# Altium schematic sheet IO_Expanders.SchDoc
size Letter
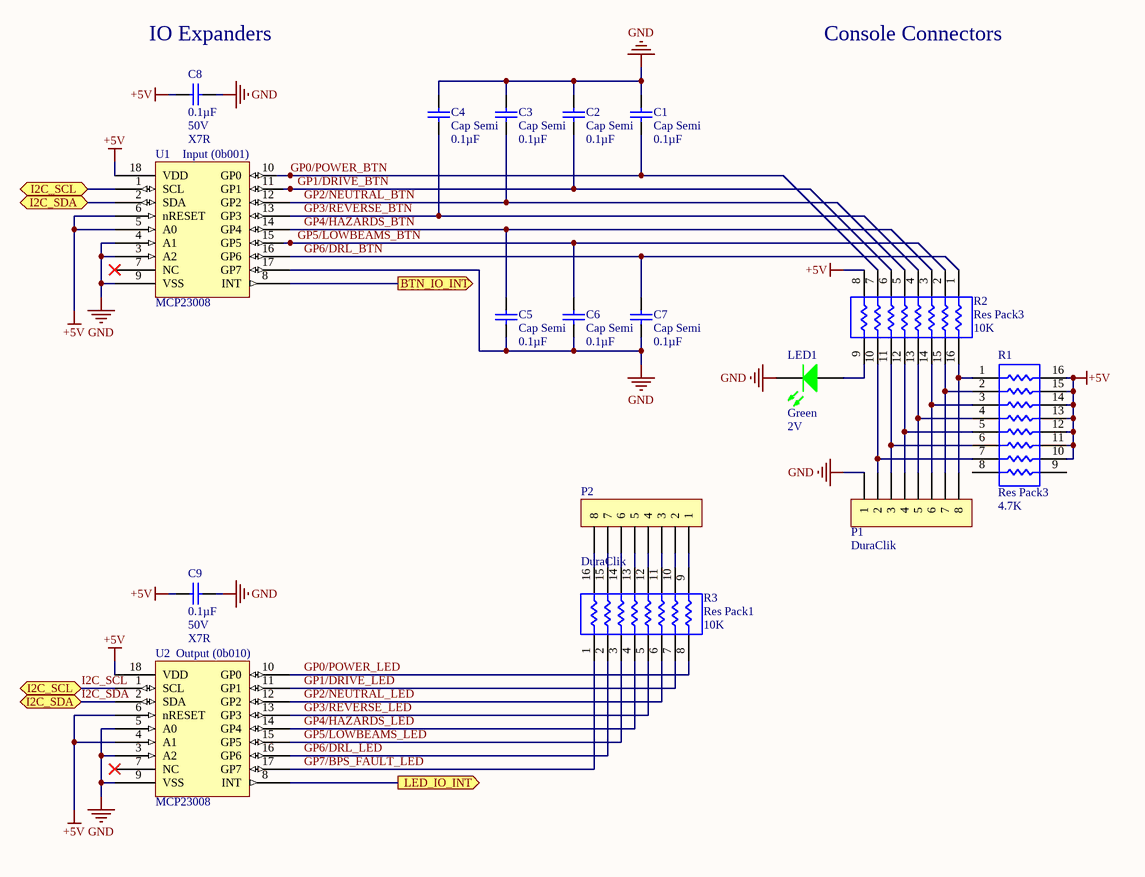
[diagram p0: IO_Expanders.SchDoc]

## Parts
C1  Cap Semi  value 0.1µF  [C1206]
C2  Cap Semi  value 0.1µF  [C1206]
C3  Cap Semi  value 0.1µF  [C1206]
C4  Cap Semi  value 0.1µF  [C1206]
C5  Cap Semi  value 0.1µF  [C1206]
C6  Cap Semi  value 0.1µF  [C1206]
C7  Cap Semi  value 0.1µF  [C1206]
C8  Capacitance: 0.1µF  Voltage: 50V  Temperature Coefficient: X7R  [CAP, 0603]  (hidden comment: CAP CER 0.1UF 50V 10% X7R 0603)
C9  Capacitance: 0.1µF  Voltage: 50V  Temperature Coefficient: X7R  [CAP, 0603]  (hidden comment: CAP CER 0.1UF 50V 10% X7R 0603)
LED1  Color: Green  Voltage - Forward (Vf) (Typ): 2V  [LED_0603]  (hidden comment: LED GREEN CLEAR 2V 0603)
P1  Series: DuraClik  [CONN, 8POS Dura-Clik]  (hidden comment: CONN 8POS DURA-CLIK 0.079")
P2  Series: DuraClik  [CONN, 8POS Dura-Clik]  (hidden comment: CONN 8POS DURA-CLIK 0.079")
R1  Res Pack3  value 4.7K  [SO-16_N]
R2  Res Pack3  value 10K  [SO-16_N]
R3  Res Pack1  value 10K  [SO-16_N]
U1  MCP23008  [IC 18SOIC]
U2  MCP23008  [IC 18SOIC]

## Ports
BTN_IO_INT (out), I2C_SCL (bidir), I2C_SDA (bidir), LED_IO_INT (out)

## Nets
+5V: C8.1 C9.1 R1.10 R1.11 R1.12 R1.13 R1.14 R1.15 R1.16 R2.8 U1.5(A0) U1.6(nRESET) U1.18(VDD) U2.4(A1) U2.6(nRESET) U2.18(VDD)
GND: C1.2 C2.1 C3.1 C4.1 C5.2 C6.2 C7.2 C8.2 C9.2 LED1.2(K) P1.1 U1.3(A2) U1.4(A1) U1.9(VSS) U1.17(GP7) U2.3(A2) U2.5(A0) U2.9(VSS)
BTN_IO_INT: U1.8(INT) ; port BTN_IO_INT
GP0/POWER_BTN: C1.1 R2.7 U1.10(GP0)
GP0/POWER_LED: R3.8 U2.10(GP0)
GP1/DRIVE_BTN: C2.2 R2.6 U1.11(GP1)
GP1/DRIVE_LED: R3.7 U2.11(GP1)
GP2/NEUTRAL_BTN: C3.2 R2.5 U1.12(GP2)
GP2/NEUTRAL_LED: R3.6 U2.12(GP2)
GP3/REVERSE_BTN: C4.2 R2.4 U1.13(GP3)
GP3/REVERSE_LED: R3.5 U2.13(GP3)
GP4/HAZARDS_BTN: C5.1 R2.3 U1.14(GP4)
GP4/HAZARDS_LED: R3.4 U2.14(GP4)
GP5/LOWBEAMS_BTN: C6.1 R2.2 U1.15(GP5)
GP5/LOWBEAMS_LED: R3.3 U2.15(GP5)
GP6/DRL_BTN: C7.1 R2.1 U1.16(GP6)
GP6/DRL_LED: R3.2 U2.16(GP6)
GP7/BPS_FAULT_LED: R3.1 U2.17(GP7)
I2C_SCL: U1.1(SCL) U2.1(SCL) ; port I2C_SCL
I2C_SDA: U1.2(SDA) U2.2(SDA) ; port I2C_SDA
LED_IO_INT: U2.8(INT) ; port LED_IO_INT
NetLED1_1: LED1.1(A) R2.9
NetP1_2: P1.2 R1.7 R2.10
NetP1_3: P1.3 R1.6 R2.11
NetP1_4: P1.4 R1.5 R2.12
NetP1_5: P1.5 R1.4 R2.13
NetP1_6: P1.6 R1.3 R2.14
NetP1_7: P1.7 R1.2 R2.15
NetP1_8: P1.8 R1.1 R2.16
NetP2_1: P2.1 R3.9
NetP2_2: P2.2 R3.10
NetP2_3: P2.3 R3.11
NetP2_4: P2.4 R3.12
NetP2_5: P2.5 R3.13
NetP2_6: P2.6 R3.14
NetP2_7: P2.7 R3.15
NetP2_8: P2.8 R3.16

Not connected (* = marked no-connect by the designer): R1 8 9; U1 7(NC)*; U2 7(NC)*

## Notes on the sheet
- (near C8) IO Expanders
- Console Connectors
- (near U1) Input (0b001)
- (near U2) Output (0b010)
- Project:
- Title:
- Size:
- Project Author
- Letter
- Revision:
- University of Waterloo
- 200 University Ave W
- Waterloo, ON, Canada
- N2L 3E9
- Date:
- Sheet
- of
- Website:

## Library data of the parts
C1-C7 = Cap Semi: Capacitor (Semiconductor SIM Model); Published: 8-Jun-2000; LatestRevisionDate: 29-May-2009; LatestRevisionNote: IPC-7351 Footprint Added.; PackageReference: C1206; Publisher: Altium Limited; PackageDescription: Chip Capacitor
C8 C9 = CAP CER 0.1UF 50V 10% X7R 0603: 0.10µF ±10% 50V Ceramic Capacitor X7R 0603 (1608 Metric); Manufacturer 1: AVX Corporation; Manufacturer Part Number 1: 06035C104KAT2A; Supplier 1: Digi-Key; Supplier Part Number 1: 478-5052-1-ND; Packaging: Cut Tape (CT); Part Status: Active; Operating Temperature: -55°C ~ 125°C; Ratings: -; Mounting Type: Surface Mount, MLCC; Package / Case: 0603 (1608 Metric); Size / Dimension: 0.063" L x 0.032" W (1.60mm x 0.81mm); Height - Seated (Max): -; Thickness (Max): 0.035" (0.90mm); Lead Spacing: -; Lead Style: -; ComponentLink1URL: http://datasheets.avx.com/X7RDielectric.pdf; ComponentLink1Description: http://datasheets.avx.com/X7RDielectric.pdf; Tolerance: ±10%
LED1 = LED GREEN CLEAR 2V 0603: Green 572nm LED Indication - Discrete 2V 0603 (1608 Metric); Manufacturer: Wurth Electronics Inc.; Manufacturer Part Number: 150060VS75000; Lens Color: Colorless; Millicandela Rating: 40mcd; Lens Style/Size: Rectangle with Flat Top, 1.10mm x 0.70mm; Current - Test: 20mA; Viewing Angle: 140°; Wavelength - Dominant: 570nm; Supplier 1: Digi-Key; RoHS: RoHS Compliant; Category: Optoelectronics; Stock 1: 9408; Pricing 1: 1=0.21, 100=0.1617, 500=0.13964 (CAD); Packaging: Cut Tape (CT); Part Status: Active; Lens Transparency: Clear; Mounting Type: Surface Mount; Wavelength - Peak: 572nm; Features: -; Package / Case: 0603 (1608 Metric); Supplier Device Package: 0603; Size / Dimension: 1.60mm L x 0.80mm W; Height (Max): 0.80mm; ComponentLink1URL: http://katalog.we-online.de/led/datasheet/150060VS75000.pdf; ComponentLink1Description: http://katalog.we-online.de/led/datasheet/150060VS75000.pdf; Supplier Part Number 1: 732-4980-1-ND
P1 P2 = CONN 8POS DURA-CLIK 0.079": 8 Positions Header Connector 0.079" (2.00mm) Surface Mount Tin; Manufacturer 1: Molex, LLC; Manufacturer Part Number 1: 5600200820; Style: Board to Cable/Wire; Shrouding: Shrouded - 4 Wall; Number of Positions: 8; Number of Positions Loaded: All; Mated Stacking Heights: 9.3mm; Supplier 1: Digi-Key; Supplier Part Number 1: WM10868CT-ND; Packaging: Cut Tape (CT); Part Status: Active; Connector Type: Header; Contact Type: Male Pin; Pitch - Mating: 0.079" (2.00mm); Number of Rows: 1; Row Spacing - Mating: -; Mounting Type: Surface Mount; Termination: Solder; Fastening Type: Latch Lock; Contact Length - Mating: -; Contact Length - Post: -; Overall Contact Length: -; Insulation Height: 0.315" (8.00mm); Contact Shape: Square; Contact Finish - Mating: Tin; Contact Finish Thickness - Mating: -; Contact Finish - Post: Tin; Contact Material: Copper Alloy; Insulation Material: Polyamide (PA), Nylon; Operating Temperature: -; Ingress Protection: -; Material Flammability Rating: -; Insulation Color: Natural; Current Rating: -; Contact Finish Thickness - Post: -; ComponentLink1URL: http://www.molex.com/pdm_docs/sd/5600200820_sd.pdf; ComponentLink1Description: http://www.molex.com/pdm_docs/sd/5600200820_sd.pdf; Voltage: -
R1-R3 = Res Pack3: Isolated Resistor Network; Published: 24-Mar-1999; LatestRevisionDate: 29-May-2009; LatestRevisionNote: IPC-7351 Footprint Added.; PackageReference: SO-16; Publisher: Altium Limited; PackageDescription: 16-Pin Small Outline Integrated Circuit 1.27 mm Pitch; Code_JEDEC: MS-012-AC; Code_IPC: SOIC127P600-16
U1 U2 = IC I/O EXPANDER I2C 8B 18SOIC: MCP23008 I/O Expander 8B+1Int 18P SOIC; Manufacturer: Microchip Technology; Manufacturer Part Number: MCP23008T-E/SO; Number of I/O: 8; Interface: I²C; Interrupt Output: Yes; Output Type: Push-Pull; Current - Output Source/Sink: 25mA; Voltage - Supply: 1.8 V ~ 5.5 V; Supplier 1: Digi-Key; Supplier Part Number 1: MCP23008T-E/SOCT-ND; RoHS: RoHS Compliant; Category: Integrated Circuits (ICs); Stock 1: 5607; Pricing 1: 1=1.62, 25=1.3548, 100=1.2431 (CAD); Packaging: Cut Tape (CT); Part Status: Active; Features: POR; Operating Temperature: -40°C ~ 125°C; Mounting Type: Surface Mount; Package / Case: 18-SOIC (0.295", 7.50mm Width); Supplier Device Package: 18-SOIC; ComponentLink1URL: http://www.microchip.com/mymicrochip/filehandler.aspx?ddocname=en021920; ComponentLink1Description: http://www.microchip.com/mymicrochip/filehandler.aspx?ddocname=en021920